# EAGLE schematic schema (EAGLE 9.5.2)
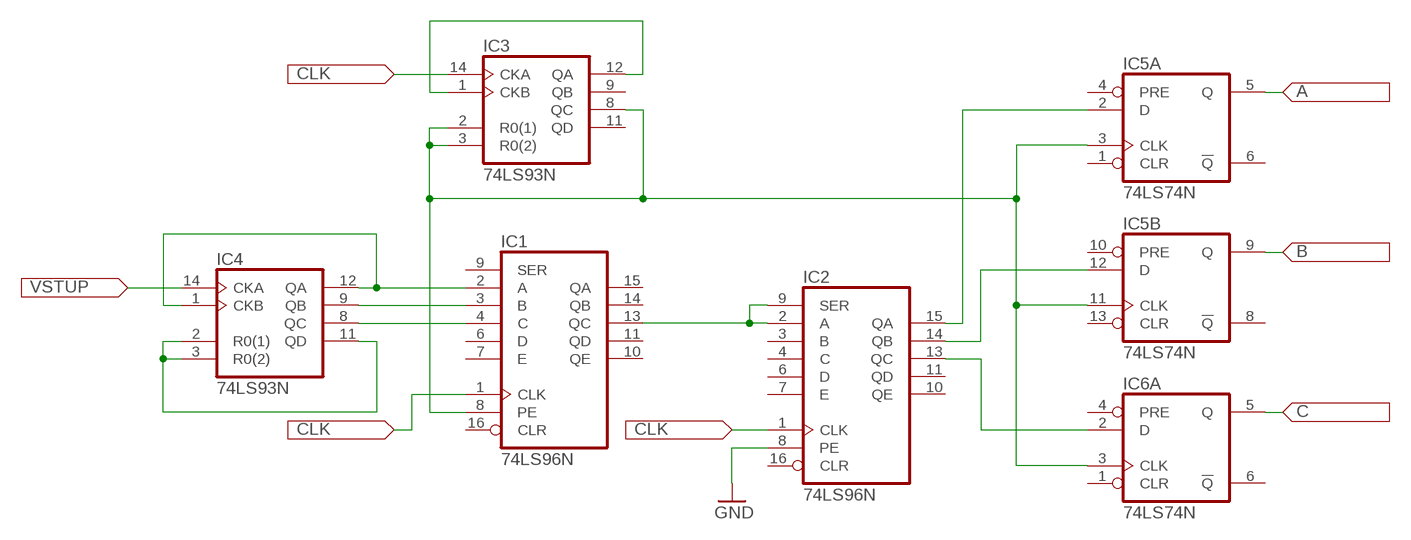
[diagram p0: schematic, sheet 1]

## Parts
IC1  74LS96N  [DIL16]
IC2  74LS96N  [DIL16]
IC3  74LS93N  [DIL14]
IC4  74LS93N  [DIL14]
IC5  74LS74N  [DIL14]
IC6  74LS74N  [DIL14]

## Nets
GND: IC2.8(PE)
N$1: IC1.13(QC) IC2.2(A) IC2.9(SER)
N$2: IC3.1(CKB) IC3.12(QA)
N$3: IC1.2(A) IC4.1(CKB) IC4.12(QA)
N$4: IC3.14(CKA)
N$5: IC2.15(QA) IC5.2(A:D)
N$6: IC2.14(QB) IC5.12(B:D)
N$7: IC2.13(QC) IC6.2(A:D)
N$8: IC1.8(PE) IC3.2(R0(1)) IC3.3(R0(2)) IC3.8(QC) IC5.3(A:CLK) IC5.11(B:CLK) IC6.3(A:CLK)
N$9: IC1.1(CLK)
N$10: IC2.1(CLK)
N$11: IC1.3(B) IC4.9(QB)
N$12: IC1.4(C) IC4.8(QC)
N$13: IC4.2(R0(1)) IC4.3(R0(2)) IC4.11(QD)
N$14: IC4.14(CKA)
N$15: IC5.5(A:Q)
N$16: IC5.9(B:Q)
N$17: IC6.5(A:Q)
Unconnected: IC1.6(D) IC1.7(E) IC1.9(SER) IC1.10(QE) IC1.11(QD) IC1.14(QB) IC1.15(QA) IC1.16(CLR) IC2.3(B) IC2.4(C) IC2.6(D) IC2.7(E) IC2.10(QE) IC2.11(QD) IC2.16(CLR) IC3.9(QB) IC3.11(QD) IC5.1(A:CLR) IC5.4(A:PRE) IC5.6(A:!Q) IC5.8(B:!Q) IC5.10(B:PRE) IC5.13(B:CLR) IC6.1(A:CLR) IC6.4(A:PRE) IC6.6(A:!Q) IC6.8(B:!Q) IC6.9(B:Q) IC6.10(B:PRE) IC6.11(B:CLK) IC6.12(B:D) IC6.13(B:CLR)

## Power pins joined to a net without a drawn wire
GND: IC1.12(GND) IC2.12(GND) IC3.10(GND) IC4.10(GND) IC5.7(P:GND) IC6.7(P:GND)
VCC: IC1.5(VCC) IC2.5(VCC) IC3.5(VCC) IC4.5(VCC) IC5.14(P:VCC) IC6.14(P:VCC)

## Library data of the parts
IC1 IC2 = 74xx-us:74*96: 5-bit SHIFT REGISTER
IC3 IC4 = 74xx-us:74*93: Decade, divide by twelve and binary COUNTER
IC5 IC6 = 74xx-us:74*74: Dual D type positive edge triggered FLIP FLOP, preset and clear